# EAGLE design pcb4 (EAGLE 7.1.0)
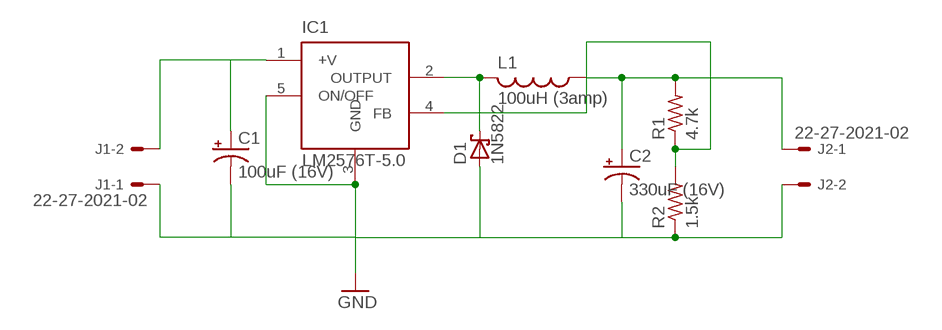
[diagram p0: schematic, sheet 1]

## Parts
C1  100uF (16V)  CPOL-USTT2D6  [TT2D6]
C2  330uF (16V)  CPOL-USTT5D10  [TT5D10]
D1  1N5822  1N5908  [C4111-15]
IC1  LM2576T-5.0  [TO220-5]
J1  22-27-2021-02  [6410-02]
J2  22-27-2021-02  [6410-02]
L1  100uH (3amp)  L-USTJ3-U1  [TJ3-U1]
R1  4.7k  R-US_0204/7  [0204/7]
R2  1.5k  R-US_0204/7  [0204/7]

## Nets
GND: C1.- C2.- D1.A IC1.3(GND) IC1.5(ON/OFF) J1.1 J2.2 R2.1
N$1: IC1.4(FB) R1.1 R2.2
N$2: C1.+ IC1.1(+V) J1.2
N$3: D1.C IC1.2(OUTPUT) L1.2
N$4: C2.+ J2.1 L1.1 R1.2

## Library data of the parts
C1 C2 = adafruit:CPOL-US: POLARIZED CAPACITOR, American symbol
D1 = diode:1N5908: DIODE schottky
IC1 = LM2576:LM2576*: Switching Step-Down Voltage Regulator Capable of 3A output current. Wide input voltage range. Temp range -40 to 125 C
J1 J2 = con-molex:22-?-02: CONNECTOR wire to board 2.54 mm (.1 inch) pitch header; OC_FARNELL: unknown; OC_NEWARK: unknown
L1 = resistor:L-US: INDUCTOR, American symbol
R1 R2 = adafruit:R-US_: RESISTOR, American symbol

## Board
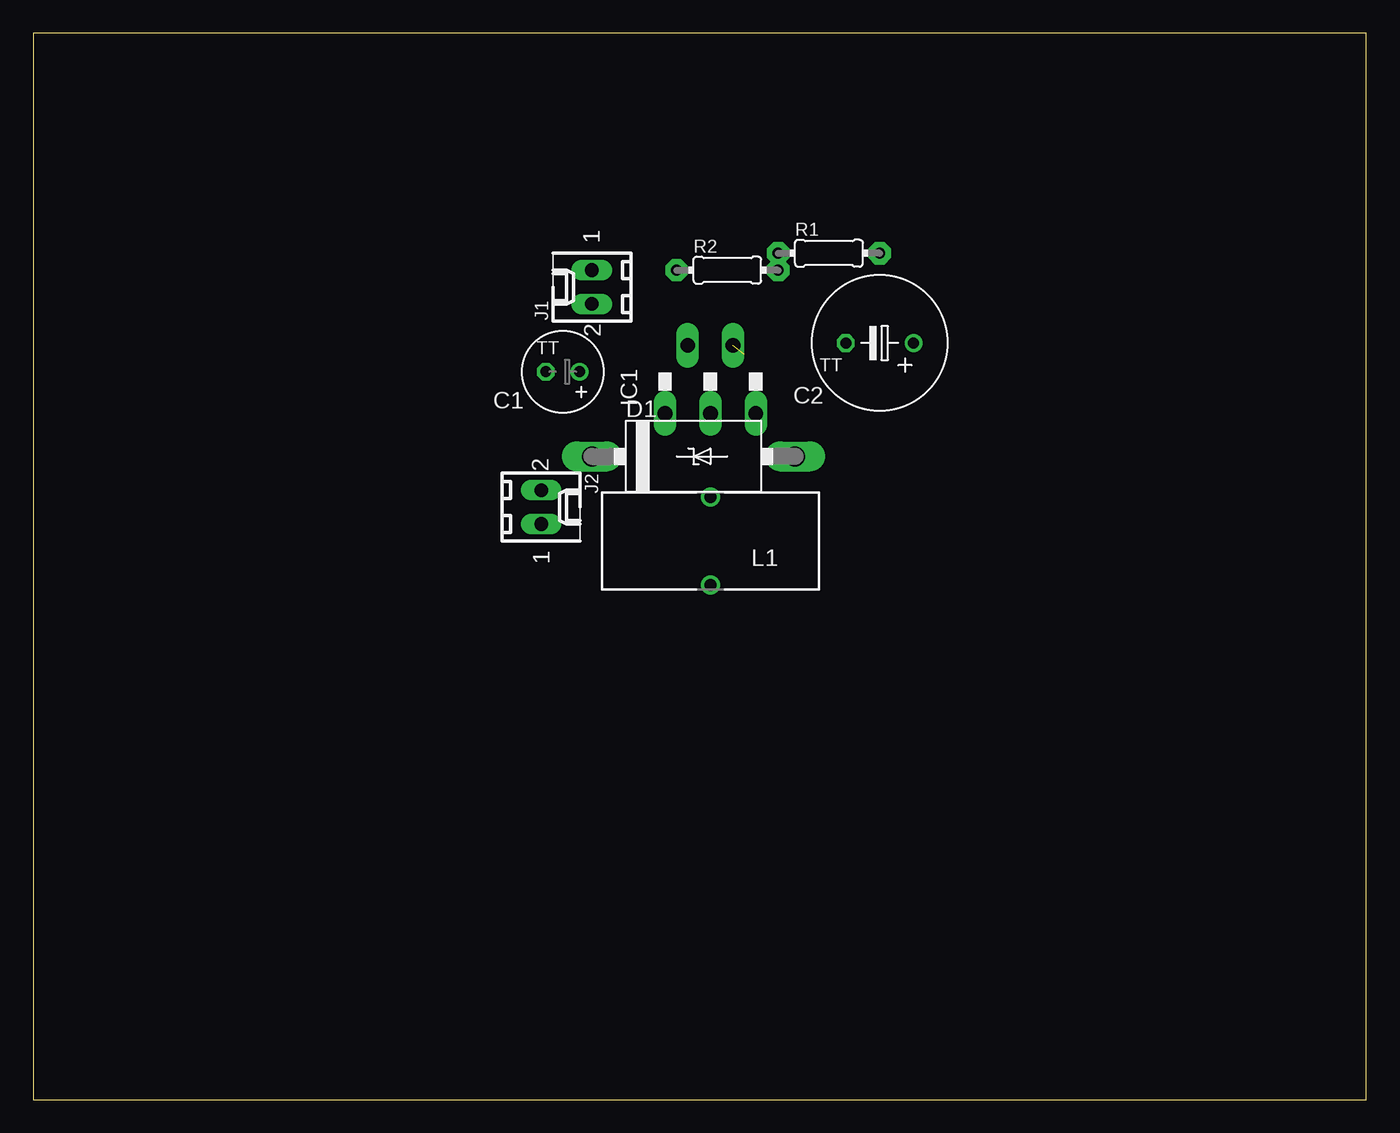
[diagram p1: board, top side]
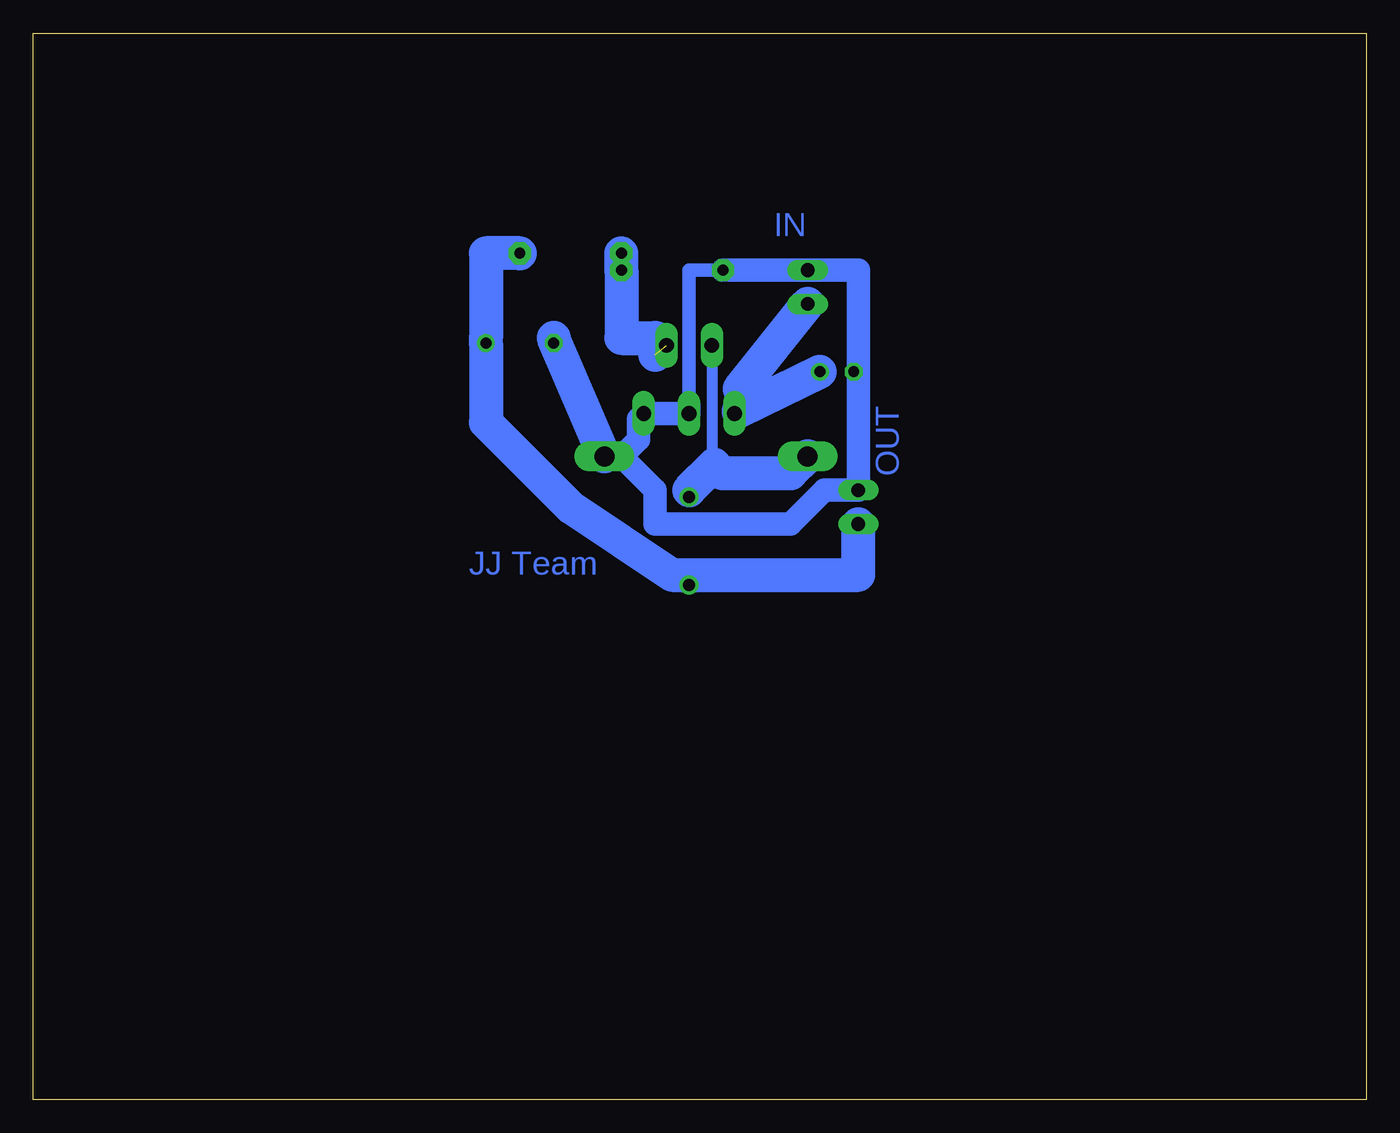
[diagram p2: board, bottom side, seen from below]

Size 100 x 80 mm. Coordinates in mm from the lower left corner, seen from the top.
Outline: 0,0 100,0 100,80 0,80 0,0
Copper layers (1*16): Top 0.035mm / dielectric 1.5mm / Bottom 0.035mm
Design rules "default": minimum track width 10mil, minimum drill 24mil, track to track 8mil, track to pad 8mil, pad to pad 8mil, via to via 8mil, smd to smd 8mil, copper to edge 40mil, drill to drill 8mil, minimum pad ring 10mil, minimum via ring 8mil, stop-mask expansion 4mil, vias tented up to drill 0mil, thermal gap 10mil

### Footprints (pad centres in the part's own frame; a part is rotated, then mirrored left to right if it is on the bottom)
TT2D6 = drill 0.813: + -1.27,0 | drill 0.813 octagon: - 1.27,0
TT5D10 = drill 0.813: + -2.54,0 | drill 0.813 octagon: - 2.54,0
C4111-15 = drill 1.499 long: A 7.62,0; C -7.62,0
TO220-5 = drill 1.118 pad 1.626 long: 1 -3.404,-8.211; 2 -1.702,-3.105; 3 0,-8.211; 4 1.702,-3.105; 5 3.404,-8.211
6410-02 = drill 1.016 long: 1 1.27,0; 2 -1.27,0
TJ3-U1 = drill 0.9: 1 -3.3,0; 2 3.3,0
0204/7 = drill 0.813 pad 1.676 octagon: 1 -3.81,0; 2 3.81,0

### Placement (x,y rotation side)
C1  39.71,54.61 180 top
C2  63.5,56.76 180 top
D1  49.53,48.26 0 top
IC1  50.8,59.69 0 top
J1  41.91,60.96 90 top
J2  38.1,44.45 270 top
L1  50.8,41.91 90 top
R1  59.69,63.5 0 top
R2  52.07,62.23 0 top

### Tracks (layer width: path | path; a pad name or v marks a point on that pad's centre or on a via)
GND
  Bottom 0.254: 60.96,57.15 C2.- | 38.1,54.61 C1.-
  Bottom 1.016: R2.1 50.8,62.23 50.8,52.07
  Bottom 1.778: R2.1 J1.1 38.1,62.23 38.1,54.61 J2.2 40.64,45.72 43.18,43.18 53.34,43.18 53.34,45.72 55.88,48.26 | D1.A 55.88,48.26 | 55.88,48.26 54.61,49.53 54.61,51.07 IC1.5 IC1.3 50.8,52.07
  Bottom 2.54: D1.A 60.96,57.15
N$1  (1 unrouted)
  Bottom 2.54: R1.1 R2.2 55.88,57.15 53.34,57.15 53.34,55.88
N$2
  Bottom 0.254: IC1.1 47.32,51.66 47.32,50.93 47.07,51.65
  Bottom 1.676: 46.99,53.34 47.07,51.65
  Bottom 2.54: 46.99,53.34 J1.2 | 47.07,51.65 C1.+
N$3
  Bottom 0.813: IC1.2 49.1,47.83 48.9,47.62 48.26,46.99 | L1.2 50.8,45.72
  Bottom 2.54: 48.26,46.99 43.18,46.99 D1.C | 50.8,45.72 48.9,47.62
N$4
  Bottom 0.254: 52.07,39.37 L1.1 | 66.04,57.15 C2.+
  Bottom 2.54: 66.04,57.15 66.04,63.5 R1.2 | C2.+ 66.04,50.8 59.69,44.45 52.07,39.37 38.1,39.37 J2.1

### Text on the board
Bottom: IN | OUT | JJ Team